# Altium schematic sheet mcu.SchDoc: MCU
size A4; Author: Peilin Perry Xu; CompanyName: N/A; DrawnBy: Peilin Perry Xu; Engineer: Peilin Perry Xu; Organization: N/A; Address1: 89 Chestnut Street, Toronto, ON, Canada; Address2: 79 Brass Drive, Richmond Hill, ON, Canada; DocumentNumber: 8; Revision: 1; SheetNumber: 11; SheetTotal: 11
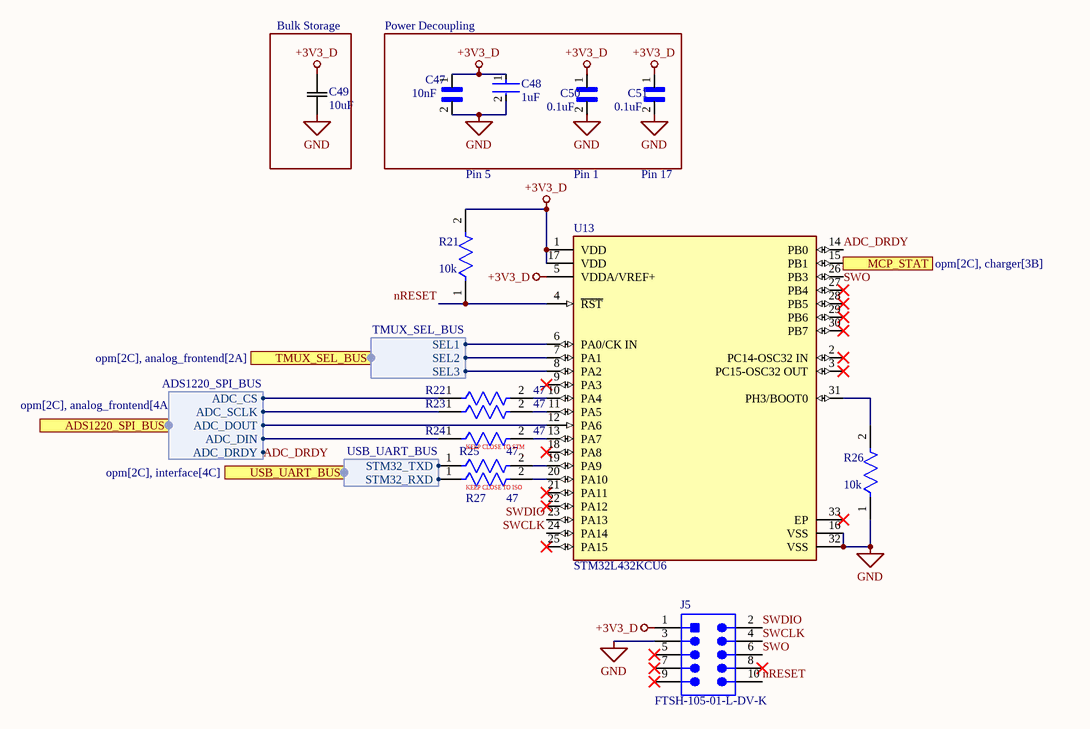
[diagram p0: mcu.SchDoc]

## Parts
C47  10nF  [CC0603JRX7R8BB104]
C48  1uF  [CC0805KKX7R7BB106]
C49  10uF  [CC0805KKX7R7BB106]
C50  0.1uF  [CC0603JRX7R8BB104]
C51  0.1uF  [CC0603JRX7R8BB104]
J5  FTSH-105-01-L-DV-K  [SMTC-FTSH-105-01-L-DV-K_V]
R21  10k  [RC0603FR-07]
R22  47  [RC0603FR-07]
R23  47  [RC0603FR-07]
R24  47  [RC0603FR-07]
R25  47  [RC0603FR-07]
R26  10k  [RC0603FR-07]
R27  47  [RC0603FR-07]
U13  STM32L432KCU6  [STM32L432KCU6]

## Blocks framed on the sheet
Bulk Storage: C49
Power Decoupling: C47 C48 C50 C51

## Ports
ADS1220_SPI_BUS (harness ADS1220_SPI_BUS, see opm[2C], analog_frontend[4A]), MCP_STAT (in, see opm[2C], charger[3B]), TMUX_SEL_BUS (harness TMUX_SEL_BUS, see opm[2C], analog_frontend[2A]), USB_UART_BUS (harness USB_UART_BUS, see opm[2C], interface[4C])

## Harnesses
USB_UART_BUS: STM32_RXD, STM32_TXD
ADS1220_SPI_BUS: ADC_CS, ADC_DIN, ADC_DOUT, ADC_SCLK, ADC_DRDY
TMUX_SEL_BUS: SEL1, SEL2, SEL3

## Nets
+3V3_D: C47.1 C48.1 C49.1 C50.1 C51.1 J5.1 R21.2 U13.1(VDD) U13.5(VDDA/VREF+) U13.17(VDD)
GND: C47.2 C48.2 C49.2 C50.2 C51.2 J5.3 R26.1 U13.16(VSS) U13.32(VSS)
ADC_DRDY: U13.14(PB0) ; port ADS1220_SPI_BUS.ADC_DRDY
MCP_STAT: U13.15(PB1) ; port MCP_STAT
nRESET: J5.10 R21.1 U13.4(~{RST})
SWCLK: J5.4 U13.24(PA14)
SWDIO: J5.2 U13.23(PA13)
SWO: J5.6 U13.26(PB3)
NetR22_1: R22.1 ; port ADS1220_SPI_BUS.ADC_CS
NetR22_2: R22.2 U13.10(PA4)
NetR23_1: R23.1 ; port ADS1220_SPI_BUS.ADC_SCLK
NetR23_2: R23.2 U13.11(PA5)
NetR24_1: R24.1 ; port ADS1220_SPI_BUS.ADC_DIN
NetR24_2: R24.2 U13.13(PA7)
NetR25_1: R25.1 ; port USB_UART_BUS.STM32_TXD
NetR25_2: R25.2 U13.19(PA9)
NetR26_2: R26.2 U13.31(PH3/BOOT0)
NetR27_1: R27.1 ; port USB_UART_BUS.STM32_RXD
NetR27_2: R27.2 U13.20(PA10)
NetU13_6: U13.6(PA0/CK_IN) ; port TMUX_SEL_BUS.SEL1
NetU13_7: U13.7(PA1) ; port TMUX_SEL_BUS.SEL2
NetU13_8: U13.8(PA2) ; port TMUX_SEL_BUS.SEL3
NetU13_12: U13.12(PA6) ; port ADS1220_SPI_BUS.ADC_DOUT

Not connected (* = marked no-connect by the designer): J5 5* 7* 8* 9*; U13 2(PC14-OSC32_IN)* 3(PC15-OSC32_OUT)* 9(PA3)* 18(PA8)* 21(PA11)* 22(PA12)* 25(PA15)* 27(PB4)* 28(PB5)* 29(PB6)* 30(PB7)* 33(EP)*

## Notes on the sheet
- Pin 5
- Pin 1
- Pin 17
- KEEP CLOSE TO STM
- (near R27) KEEP CLOSE TO ISO

## Library data of the parts
C47 = CC0603JRX7R8BB103: 25V 10nF X7R ±5% 0603 Multilayer Ceramic Capacitors MLCC - SMD/SMT ROHS; Manufacturer: Yageo Group; Dissipation Factor: 2.5%; Insulation Resistance: 10GΩ; Supplier: DigiKey; Supplier Part Number: 311-3995-1-ND; Manufacturer Part Number: CC0603JRX7R8BB103; RoHS: Compliant; Category: Ceramic Capacitors; Stock: 4508; Pricing: 1=0.1, 10=0.046, 50=0.0312, 100=0.0269, 500=0.01954, 1000=0.01728 (USD); Value: 10nF; Case/Package: 0603; Case Code (Imperial): 0603; Case Code (Metric): 1608; China RoHS: Compliant; Composition: Ceramic; Country of Origin: Mainland China, Taiwan; Depth: 800µm; Dielectric: X7R; Dielectric Material: Ceramic; Export Control Classification Number (ECCN) Code: EAR99; Halogen Free: Halogen Free; Height: 800µm; Harmonized Tariff Schedule (HTS) Code: 8532.24.00.20; Introduction Date: 2003-01-27; Lead Free: Lead Free; Length: 1.6mm; Lifecycle Status: Production; Max Operating Temperature: 125°C; Min Operating Temperature: -55°C; Mounting Technology: Surface Mount; Number of Terminals: 2; Radiation Hardening: No; REACH SVHC: Yes; Schedule B: 8532240020, 8532240020|8532240020|8532240020|8532240020|8532240020; Termination: SMD/SMT; Thickness: 889µm; Tolerance: 5%; Voltage Rating: 25V; Voltage Rating (DC): 25V; Weight: 2.012816mg; Width: 800µm; ComponentLink1URL: https://datasheet.octopart.com:443/CC0603JRX7R8BB103-Yageo-datasheet-177165144.pdf?src-supplier=IHS; ComponentLink1Description: https://datasheet.octopart.com:443/CC0603JRX7R8BB103-Yageo-datasheet-177165144.pdf?src-supplier=IHS; ComponentLink2URL: https://datasheet.octopart.com:443/CC0603JRX7R8BB103-Yageo-datasheet-182029658.pdf?src-supplier=Farnell; ComponentLink2Description: https://datasheet.octopart.com:443/CC0603JRX7R8BB103-Yageo-datasheet-182029658.pdf?src-supplier=Farnell; ComponentLink3URL: https://datasheet.octopart.com:443/CC0603JRX7R8BB103-Yageo-datasheet-182029654.pdf?src-supplier=Farnell; ComponentLink3Description: https://datasheet.octopart.com:443/CC0603JRX7R8BB103-Yageo-datasheet-182029654.pdf?src-supplier=Farnell; ComponentLink4URL: https://datasheet.octopart.com:443/CC0603JRX7R8BB103-Yageo-datasheet-147453679.pdf?src-supplier=Farnell; ComponentLink4Description: https://datasheet.octopart.com:443/CC0603JRX7R8BB103-Yageo-datasheet-147453679.pdf?src-supplier=Farnell; ComponentLink5URL: https://datasheet.octopart.com:443/CC0603JRX7R8BB103-Yageo-datasheet-151948686.pdf?src-supplier=Farnell; ComponentLink5Description: https://datasheet.octopart.com:443/CC0603JRX7R8BB103-Yageo-datasheet-151948686.pdf?src-supplier=Farnell; ComponentLink6URL: https://datasheet.octopart.com/CC0603JRX7R8BB103-Yageo-datasheet-10883670.pdf; ComponentLink6Description: https://datasheet.octopart.com/CC0603JRX7R8BB103-Yageo-datasheet-10883670.pdf; ComponentLink7URL: https://datasheet.octopart.com:443/CC0603JRX7R8BB103-Yageo-datasheet-166511530.pdf?src-supplier=Future+Electronics; ComponentLink7Description: https://datasheet.octopart.com:443/CC0603JRX7R8BB103-Yageo-datasheet-166511530.pdf?src-supplier=Future+Electronics; ComponentLink8URL: https://datasheet.octopart.com:443/CC0603JRX7R8BB103-Yageo-datasheet-137700082.pdf?src-supplier=Future+Electronics; ComponentLink8Description: https://datasheet.octopart.com:443/CC0603JRX7R8BB103-Yageo-datasheet-137700082.pdf?src-supplier=Future+Electronics; ComponentLink9URL: https://datasheet.octopart.com:443/CC0603JRX7R8BB103-Yageo-datasheet-137700084.pdf?src-supplier=Future+Electronics; ComponentLink9Description: https://datasheet.octopart.com:443/CC0603JRX7R8BB103-Yageo-datasheet-137700084.pdf?src-supplier=Future+Electronics; ComponentLink10URL: https://datasheet.octopart.com:443/CC0603JRX7R8BB103-Yageo-datasheet-27626582.pdf?src-supplier=Future+Electronics; ComponentLink10Description: https://datasheet.octopart.com:443/CC0603JRX7R8BB103-Yageo-datasheet-27626582.pdf?src-supplier=Future+Electronics; ComponentLink11URL: https://datasheet.octopart.com:443/CC0603JRX7R8BB103-Yageo-datasheet-15895757.pdf?src-supplier=Future+Electronics; ComponentLink11Description: https://datasheet.octopart.com:443/CC0603JRX7R8BB103-Yageo-datasheet-15895757.pdf?src-supplier=Future+Electronics; ComponentLink12URL: https://datasheet.octopart.com:443/CC0603JRX7R8BB103-Yageo-datasheet-12526321.pdf?src-supplier=Future+Electronics; ComponentLink12Description: https://datasheet.octopart.com:443/CC0603JRX7R8BB103-Yageo-datasheet-12526321.pdf?src-supplier=Future+Electronics; ComponentLink13URL: https://datasheet.octopart.com:443/CC0603JRX7R8BB103-Yageo-datasheet-10911834.pdf?src-supplier=Future+Electronics; ComponentLink13Description: https://datasheet.octopart.com:443/CC0603JRX7R8BB103-Yageo-datasheet-10911834.pdf?src-supplier=Future+Electronics; ComponentLink14URL: https://datasheet.octopart.com:443/CC0603JRX7R8BB103-Yageo-datasheet-8324442.pdf?src-supplier=Future+Electronics; ComponentLink14Description: https://datasheet.octopart.com:443/CC0603JRX7R8BB103-Yageo-datasheet-8324442.pdf?src-supplier=Future+Electronics; ComponentLink15URL: https://datasheet.octopart.com:443/CC0603JRX7R8BB103-Yageo-Group-datasheet-165992755.pdf?src-supplier=ODG+(Origin+Data+Global); ComponentLink15Description: https://datasheet.octopart.com:443/CC0603JRX7R8BB103-Yageo-Group-datasheet-165992755.pdf?src-supplier=ODG+(Origin+Data+Global); ComponentLink16URL: http://sigma.octopart.com:80/conflict_mineral_statement/Yageo-company-3.pdf?src-supplier=Compliance+Statements; ComponentLink16Description: http://sigma.octopart.com:80/conflict_mineral_statement/Yageo-company-3.pdf?src-supplier=Compliance+Statements; ComponentLink17URL: http://sigma.octopart.com:80/rohs_statement/Yageo-company-2.pdf?src-supplier=Compliance+Statements; ComponentLink17Description: http://sigma.octopart.com:80/rohs_statement/Yageo-company-2.pdf?src-supplier=Compliance+Statements; Supplier 1: DigiKey; Supplier Part Number 1: 311-3995-1-ND
C48 = CC0805KKX7R7BB105: 16V 1uF X7R ±10% 0805 Multilayer Ceramic Capacitors MLCC - SMD/SMT ROHS; Manufacturer: Yageo Group; Manufacturer Package Identifier: CC0805-0.85; Value: 1µF; Supplier: DigiKey; Supplier Part Number: 311-1365-1-ND; Manufacturer Part Number: CC0805KKX7R7BB105; RoHS: Compliant; Category: Ceramic Capacitors; Stock: 898629; Pricing: 1=0.13, 10=0.072, 50=0.05, 100=0.0434, 500=0.0323, 1000=0.02889 (USD); Case/Package: 0805; Case Code (Imperial): 0805; Case Code (Metric): 2012; China RoHS: Compliant; Country of Origin: Mainland China, Taiwan; Depth: 1.25mm; Dielectric: X7R; Dielectric Material: Ceramic; Export Control Classification Number (ECCN) Code: EAR99; Halogen Free: Halogen Free; Height: 1.25mm; Harmonized Tariff Schedule (HTS) Code: 8532.24.00.20; Introduction Date: 2009-04-17; Lead Free: Lead Free; Length: 2mm; Lifecycle Status: Production; Material: Ceramic; Max Operating Temperature: 125°C; Min Operating Temperature: -55°C; Mounting Technology: Surface Mount; Pins: 2; Number of Terminals: 2; Radiation Hardening: No; REACH SVHC: Yes; Schedule B: 8532240020, 8532240020|8532240020|8532240020|8532240020|8532240020|8532240020|8532240020|8532240020|8532240020|8532240020|8532240020|8532240020, 8532240020|8532240020|8532240020|8532240020|8532240020|8532240020|8532240020|8532240020|8532240020|8532240020|8532240020|8532240020|8532240020, 8532240020|8532240020|8532240020|8532240020|8532240020|8532240020|8532240020|8532240020|8532240020|8532240020|8532240020|8532240020|8532240020|8532240020; Termination: SMD/SMT; Thickness: 1.2446mm; Tolerance: 10%; Voltage Rating: 16V; Voltage Rating (DC): 16V; Width: 1.25mm; ComponentLink1URL: https://datasheet.octopart.com:443/CC0805KKX7R7BB105-Yageo-datasheet-177165144.pdf?src-supplier=IHS; ComponentLink1Description: https://datasheet.octopart.com:443/CC0805KKX7R7BB105-Yageo-datasheet-177165144.pdf?src-supplier=IHS; ComponentLink2URL: https://datasheet.octopart.com:443/CC0805KKX7R7BB105-Yageo-datasheet-78855689.pdf?src-supplier=Upverter; ComponentLink2Description: https://datasheet.octopart.com:443/CC0805KKX7R7BB105-Yageo-datasheet-78855689.pdf?src-supplier=Upverter; ComponentLink3URL: https://datasheet.octopart.com:443/CC0805KKX7R7BB105-Yageo-Group-datasheet-189192896.pdf?src-supplier=Future+Electronics; ComponentLink3Description: https://datasheet.octopart.com:443/CC0805KKX7R7BB105-Yageo-Group-datasheet-189192896.pdf?src-supplier=Future+Electronics; ComponentLink4URL: https://datasheet.octopart.com:443/CC0805KKX7R7BB105-Yageo-datasheet-166511530.pdf?src-supplier=Future+Electronics; ComponentLink4Description: https://datasheet.octopart.com:443/CC0805KKX7R7BB105-Yageo-datasheet-166511530.pdf?src-supplier=Future+Electronics; ComponentLink5URL: https://datasheet.octopart.com:443/CC0805KKX7R7BB105-Yageo-datasheet-137700082.pdf?src-supplier=Future+Electronics; ComponentLink5Description: https://datasheet.octopart.com:443/CC0805KKX7R7BB105-Yageo-datasheet-137700082.pdf?src-supplier=Future+Electronics; ComponentLink6URL: https://datasheet.octopart.com:443/CC0805KKX7R7BB105-Yageo-datasheet-137700084.pdf?src-supplier=Future+Electronics; ComponentLink6Description: https://datasheet.octopart.com:443/CC0805KKX7R7BB105-Yageo-datasheet-137700084.pdf?src-supplier=Future+Electronics; ComponentLink7URL: https://datasheet.octopart.com:443/CC0805KKX7R7BB105-Yageo-datasheet-27626582.pdf?src-supplier=Future+Electronics; ComponentLink7Description: https://datasheet.octopart.com:443/CC0805KKX7R7BB105-Yageo-datasheet-27626582.pdf?src-supplier=Future+Electronics; ComponentLink8URL: https://datasheet.octopart.com:443/CC0805KKX7R7BB105-Yageo-datasheet-15895757.pdf?src-supplier=Future+Electronics; ComponentLink8Description: https://datasheet.octopart.com:443/CC0805KKX7R7BB105-Yageo-datasheet-15895757.pdf?src-supplier=Future+Electronics; ComponentLink9URL: https://datasheet.octopart.com:443/CC0805KKX7R7BB105-Yageo-datasheet-12526321.pdf?src-supplier=Future+Electronics; ComponentLink9Description: https://datasheet.octopart.com:443/CC0805KKX7R7BB105-Yageo-datasheet-12526321.pdf?src-supplier=Future+Electronics; ComponentLink10URL: https://datasheet.octopart.com:443/CC0805KKX7R7BB105-Yageo-datasheet-10911834.pdf?src-supplier=Future+Electronics; ComponentLink10Description: https://datasheet.octopart.com:443/CC0805KKX7R7BB105-Yageo-datasheet-10911834.pdf?src-supplier=Future+Electronics; ComponentLink11URL: https://datasheet.octopart.com:443/CC0805KKX7R7BB105-Yageo-datasheet-8324442.pdf?src-supplier=Future+Electronics; ComponentLink11Description: https://datasheet.octopart.com:443/CC0805KKX7R7BB105-Yageo-datasheet-8324442.pdf?src-supplier=Future+Electronics; ComponentLink12URL: https://datasheet.octopart.com/CC0805KKX7R7BB105-Yageo-datasheet-10883670.pdf; ComponentLink12Description: https://datasheet.octopart.com/CC0805KKX7R7BB105-Yageo-datasheet-10883670.pdf; ComponentLink13URL: https://datasheet.octopart.com:443/CC0805KKX7R7BB105-Yageo-datasheet-140260305.pdf?src-supplier=SOS+electronic; ComponentLink13Description: https://datasheet.octopart.com:443/CC0805KKX7R7BB105-Yageo-datasheet-140260305.pdf?src-supplier=SOS+electronic; ComponentLink14URL: https://datasheet.octopart.com:443/CC0805KKX7R7BB105-Yageo-datasheet-147453679.pdf?src-supplier=Farnell; ComponentLink14Description: https://datasheet.octopart.com:443/CC0805KKX7R7BB105-Yageo-datasheet-147453679.pdf?src-supplier=Farnell; ComponentLink15URL: https://datasheet.octopart.com:443/CC0805KKX7R7BB105-Yageo-datasheet-181969634.pdf?src-supplier=Farnell; ComponentLink15Description: https://datasheet.octopart.com:443/CC0805KKX7R7BB105-Yageo-datasheet-181969634.pdf?src-supplier=Farnell; ComponentLink16URL: https://datasheet.octopart.com:443/CC0805KKX7R7BB105-Yageo-datasheet-62336348.pdf?src-supplier=element14+APAC; ComponentLink16Description: https://datasheet.octopart.com:443/CC0805KKX7R7BB105-Yageo-datasheet-62336348.pdf?src-supplier=element14+APAC; ComponentLink17URL: https://datasheet.octopart.com:443/CC0805KKX7R7BB105-Yageo-Group-datasheet-165992755.pdf?src-supplier=ODG+(Origin+Data+Global); ComponentLink17Description: https://datasheet.octopart.com:443/CC0805KKX7R7BB105-Yageo-Group-datasheet-165992755.pdf?src-supplier=ODG+(Origin+Data+Global); ComponentLink18URL: https://datasheet.octopart.com:443/CC0805KKX7R7BB105-Yageo-datasheet-151948686.pdf?src-supplier=TME; ComponentLink18Description: https://datasheet.octopart.com:443/CC0805KKX7R7BB105-Yageo-datasheet-151948686.pdf?src-supplier=TME; ComponentLink19URL: https://datasheet.octopart.com:443/CC0805KKX7R7BB105-Yageo-datasheet-8324192.pdf?src-supplier=TME; ComponentLink19Description: https://datasheet.octopart.com:443/CC0805KKX7R7BB105-Yageo-datasheet-8324192.pdf?src-supplier=TME; ComponentLink20URL: https://datasheet.octopart.com:443/CC0805KKX7R7BB105-Yageo-datasheet-120101875.pdf?src-supplier=Megastar; ComponentLink20Description: https://datasheet.octopart.com:443/CC0805KKX7R7BB105-Yageo-datasheet-120101875.pdf?src-supplier=Megastar; ComponentLink21URL: https://datasheet.octopart.com:443/CC0805KKX7R7BB105-Yageo-datasheet-8701427.pdf?src-supplier=element14; ComponentLink21Description: https://datasheet.octopart.com:443/CC0805KKX7R7BB105-Yageo-datasheet-8701427.pdf?src-supplier=element14; ComponentLink22URL: https://datasheet.octopart.com:443/CC0805KKX7R7BB105-Yageo-datasheet-499490.pdf?src-supplier=element14; ComponentLink22Description: https://datasheet.octopart.com:443/CC0805KKX7R7BB105-Yageo-datasheet-499490.pdf?src-supplier=element14; ComponentLink23URL: https://datasheet.octopart.com:443/CC0805KKX7R7BB105-Yageo-datasheet-5301394.pdf?src-supplier=element14; ComponentLink23Description: https://datasheet.octopart.com:443/CC0805KKX7R7BB105-Yageo-datasheet-5301394.pdf?src-supplier=element14; ComponentLink24URL: http://sigma.octopart.com:80/conflict_mineral_statement/Yageo-company-3.pdf?src-supplier=Compliance+Statements; ComponentLink24Description: http://sigma.octopart.com:80/conflict_mineral_statement/Yageo-company-3.pdf?src-supplier=Compliance+Statements; ComponentLink25URL: http://sigma.octopart.com:80/rohs_statement/Yageo-company-2.pdf?src-supplier=Compliance+Statements; ComponentLink25Description: http://sigma.octopart.com:80/rohs_statement/Yageo-company-2.pdf?src-supplier=Compliance+Statements; Supplier 1: DigiKey; Supplier Part Number 1: 311-1365-1-ND
C49 = CC0805KKX7R7BB106: 16V 10uF X7R ±10% 0805 Multilayer Ceramic Capacitors MLCC - SMD/SMT ROHS; Manufacturer: Yageo Group; Value: 10µF; Supplier: DigiKey; Supplier Part Number: 311-3501-1-ND; Manufacturer Part Number: CC0805KKX7R7BB106; RoHS: Compliant; Category: Ceramic Capacitors; Stock: 2785; Pricing: 1=0.54, 10=0.329, 50=0.2472, 100=0.2222, 500=0.17992, 1000=0.16687 (USD); Case/Package: 0805; China RoHS: Compliant; Country of Origin: Mainland China, Taiwan; Dielectric: X7R; Dielectric Material: Ceramic; Export Control Classification Number (ECCN) Code: EAR99; Halogen Free: Halogen Free; Height: 1.25mm; Harmonized Tariff Schedule (HTS) Code: 8532.24.00.20; Introduction Date: 2013-05-20; Lead Free: Lead Free; Length: 2mm; Lifecycle Status: Production; Max Operating Temperature: 125°C; Min Operating Temperature: -55°C; Mounting Technology: Surface Mount; Number of Terminals: 2; REACH SVHC: Yes; Voltage Rating (DC): 16V; Width: 1.25mm; ComponentLink1URL: https://datasheet.octopart.com:443/CC0805KKX7R7BB106-Yageo-datasheet-177165144.pdf?src-supplier=IHS; ComponentLink1Description: https://datasheet.octopart.com:443/CC0805KKX7R7BB106-Yageo-datasheet-177165144.pdf?src-supplier=IHS; ComponentLink2URL: https://datasheet.octopart.com:443/CC0805KKX7R7BB106-Yageo-Group-datasheet-189192896.pdf?src-supplier=TME; ComponentLink2Description: https://datasheet.octopart.com:443/CC0805KKX7R7BB106-Yageo-Group-datasheet-189192896.pdf?src-supplier=TME; ComponentLink3URL: https://datasheet.octopart.com:443/CC0805KKX7R7BB106-Yageo-datasheet-147453679.pdf?src-supplier=Farnell; ComponentLink3Description: https://datasheet.octopart.com:443/CC0805KKX7R7BB106-Yageo-datasheet-147453679.pdf?src-supplier=Farnell; ComponentLink4URL: https://datasheet.octopart.com:443/CC0805KKX7R7BB106-Yageo-datasheet-181969636.pdf?src-supplier=Farnell; ComponentLink4Description: https://datasheet.octopart.com:443/CC0805KKX7R7BB106-Yageo-datasheet-181969636.pdf?src-supplier=Farnell; ComponentLink5URL: https://datasheet.octopart.com:443/CC0805KKX7R7BB106-Yageo-datasheet-151948686.pdf?src-supplier=Farnell; ComponentLink5Description: https://datasheet.octopart.com:443/CC0805KKX7R7BB106-Yageo-datasheet-151948686.pdf?src-supplier=Farnell; ComponentLink6URL: https://datasheet.octopart.com:443/CC0805KKX7R7BB106-Yageo-datasheet-166511530.pdf?src-supplier=Future+Electronics; ComponentLink6Description: https://datasheet.octopart.com:443/CC0805KKX7R7BB106-Yageo-datasheet-166511530.pdf?src-supplier=Future+Electronics; ComponentLink7URL: https://datasheet.octopart.com:443/CC0805KKX7R7BB106-Yageo-Group-datasheet-165992755.pdf?src-supplier=ODG+(Origin+Data+Global); ComponentLink7Description: https://datasheet.octopart.com:443/CC0805KKX7R7BB106-Yageo-Group-datasheet-165992755.pdf?src-supplier=ODG+(Origin+Data+Global); ComponentLink8URL: https://datasheet.octopart.com/CC0805KKX7R7BB106-Yageo-datasheet-10883670.pdf; ComponentLink8Description: https://datasheet.octopart.com/CC0805KKX7R7BB106-Yageo-datasheet-10883670.pdf; ComponentLink9URL: http://sigma.octopart.com:80/conflict_mineral_statement/Yageo-company-3.pdf?src-supplier=Compliance+Statements; ComponentLink9Description: http://sigma.octopart.com:80/conflict_mineral_statement/Yageo-company-3.pdf?src-supplier=Compliance+Statements; ComponentLink10URL: http://sigma.octopart.com:80/rohs_statement/Yageo-company-2.pdf?src-supplier=Compliance+Statements; ComponentLink10Description: http://sigma.octopart.com:80/rohs_statement/Yageo-company-2.pdf?src-supplier=Compliance+Statements; Supplier 1: DigiKey; Supplier Part Number 1: 311-3501-1-ND
C50 C51 = CC0603JRX7R8BB104: 25V 100nF X7R ±5% 0603 Multilayer Ceramic Capacitors MLCC - SMD/SMT ROHS; Manufacturer: Yageo Group; Supplier: DigiKey; Supplier Part Number: 311-1777-1-ND; Manufacturer Part Number: CC0603JRX7R8BB104; RoHS: Compliant; Category: Ceramic Capacitors; Stock: 156739; Pricing: 1=0.1, 10=0.056, 50=0.0386, 100=0.0333, 500=0.02444, 1000=0.02172 (USD); Value: 100nF; Case/Package: 0603; Case Code (Imperial): 0603; Case Code (Metric): 1608; China RoHS: Compliant; Composition: Ceramic; Depth: 800µm; Dielectric: X7R; Dielectric Material: Ceramic; Halogen Free: Halogen Free; Height: 800µm; Lead Free: Lead Free; Length: 1.6mm; Lifecycle Status: Production; Max Operating Temperature: 125°C; Min Operating Temperature: -55°C; Mounting Technology: Surface Mount; Number of Terminals: 2; Radiation Hardening: No; REACH SVHC: Yes; Schedule B: 8532240020, 8532240020|8532240020, 8532240020|8532240020|8532240020, 8532240020|8532240020|8532240020|8532240020; Termination: SMD/SMT; Thickness: 889µm; Tolerance: 5%; Voltage Rating: 25V; Voltage Rating (DC): 25V; Weight: 2.012816mg; Width: 800µm; ComponentLink1URL: https://datasheet.octopart.com:443/CC0603JRX7R8BB104-Yageo-datasheet-177165144.pdf?src-supplier=IHS; ComponentLink1Description: https://datasheet.octopart.com:443/CC0603JRX7R8BB104-Yageo-datasheet-177165144.pdf?src-supplier=IHS; ComponentLink2URL: https://datasheet.octopart.com:443/CC0603JRX7R8BB104-Yageo-datasheet-147453679.pdf?src-supplier=Farnell; ComponentLink2Description: https://datasheet.octopart.com:443/CC0603JRX7R8BB104-Yageo-datasheet-147453679.pdf?src-supplier=Farnell; ComponentLink3URL: https://datasheet.octopart.com:443/CC0603JRX7R8BB104-Yageo-datasheet-181968346.pdf?src-supplier=Farnell; ComponentLink3Description: https://datasheet.octopart.com:443/CC0603JRX7R8BB104-Yageo-datasheet-181968346.pdf?src-supplier=Farnell; ComponentLink4URL: https://datasheet.octopart.com:443/CC0603JRX7R8BB104-Yageo-datasheet-151948686.pdf?src-supplier=TME; ComponentLink4Description: https://datasheet.octopart.com:443/CC0603JRX7R8BB104-Yageo-datasheet-151948686.pdf?src-supplier=TME; ComponentLink5URL: https://datasheet.octopart.com/CC0603JRX7R8BB104-Yageo-datasheet-12526321.pdf; ComponentLink5Description: https://datasheet.octopart.com/CC0603JRX7R8BB104-Yageo-datasheet-12526321.pdf; ComponentLink6URL: https://datasheet.octopart.com/CC0603JRX7R8BB104-Yageo-datasheet-10883670.pdf; ComponentLink6Description: https://datasheet.octopart.com/CC0603JRX7R8BB104-Yageo-datasheet-10883670.pdf; ComponentLink7URL: https://datasheet.octopart.com:443/CC0603JRX7R8BB104-Yageo-datasheet-166511530.pdf?src-supplier=Future+Electronics; ComponentLink7Description: https://datasheet.octopart.com:443/CC0603JRX7R8BB104-Yageo-datasheet-166511530.pdf?src-supplier=Future+Electronics; ComponentLink8URL: https://datasheet.octopart.com:443/CC0603JRX7R8BB104-Yageo-datasheet-137700082.pdf?src-supplier=Future+Electronics; ComponentLink8Description: https://datasheet.octopart.com:443/CC0603JRX7R8BB104-Yageo-datasheet-137700082.pdf?src-supplier=Future+Electronics; ComponentLink9URL: https://datasheet.octopart.com:443/CC0603JRX7R8BB104-Yageo-datasheet-137700084.pdf?src-supplier=Future+Electronics; ComponentLink9Description: https://datasheet.octopart.com:443/CC0603JRX7R8BB104-Yageo-datasheet-137700084.pdf?src-supplier=Future+Electronics; ComponentLink10URL: https://datasheet.octopart.com:443/CC0603JRX7R8BB104-Yageo-datasheet-27626582.pdf?src-supplier=Future+Electronics; ComponentLink10Description: https://datasheet.octopart.com:443/CC0603JRX7R8BB104-Yageo-datasheet-27626582.pdf?src-supplier=Future+Electronics; ComponentLink11URL: https://datasheet.octopart.com:443/CC0603JRX7R8BB104-Yageo-datasheet-15895757.pdf?src-supplier=Future+Electronics; ComponentLink11Description: https://datasheet.octopart.com:443/CC0603JRX7R8BB104-Yageo-datasheet-15895757.pdf?src-supplier=Future+Electronics; ComponentLink12URL: https://datasheet.octopart.com:443/CC0603JRX7R8BB104-Yageo-datasheet-10911834.pdf?src-supplier=Future+Electronics; ComponentLink12Description: https://datasheet.octopart.com:443/CC0603JRX7R8BB104-Yageo-datasheet-10911834.pdf?src-supplier=Future+Electronics; ComponentLink13URL: https://datasheet.octopart.com:443/CC0603JRX7R8BB104-Yageo-datasheet-8324442.pdf?src-supplier=Future+Electronics; ComponentLink13Description: https://datasheet.octopart.com:443/CC0603JRX7R8BB104-Yageo-datasheet-8324442.pdf?src-supplier=Future+Electronics; ComponentLink14URL: https://datasheet.octopart.com:443/CC0603JRX7R8BB104-Yageo-Group-datasheet-165992755.pdf?src-supplier=ODG+(Origin+Data+Global); ComponentLink14Description: https://datasheet.octopart.com:443/CC0603JRX7R8BB104-Yageo-Group-datasheet-165992755.pdf?src-supplier=ODG+(Origin+Data+Global); ComponentLink15URL: http://sigma.octopart.com:80/rohs_statement/Surface-Mount-Ceramic-Multilayer-Capacitors%3B-General-Purpose-%26-High-Capacitance-Class-2%2C-X7R-Yageo-family-124.pdf?src-supplier=Compliance+Statements; ComponentLink15Description: http://sigma.octopart.com:80/rohs_statement/Surface-Mount-Ceramic-Multilayer-Capacitors%3B-General-Purpose-%26-High-Capacitance-Class-2%2C-X7R-Yageo-family-124.pdf?src-supplier=Compliance+Statements; ComponentLink16URL: http://sigma.octopart.com:80/reach_statement/Surface-Mount-Ceramic-Multilayer-Capacitors%3B-General-Purpose-%26-High-Capacitance-Class-2%2C-X7R-Yageo-family-125.pdf?src-supplier=Compliance+Statements; ComponentLink16Description: http://sigma.octopart.com:80/reach_statement/Surface-Mount-Ceramic-Multilayer-Capacitors%3B-General-Purpose-%26-High-Capacitance-Class-2%2C-X7R-Yageo-family-125.pdf?src-supplier=Compliance+Statements; ComponentLink17URL: http://sigma.octopart.com:80/conflict_mineral_statement/Yageo-company-3.pdf?src-supplier=Compliance+Statements; ComponentLink17Description: http://sigma.octopart.com:80/conflict_mineral_statement/Yageo-company-3.pdf?src-supplier=Compliance+Statements; ComponentLink18URL: http://sigma.octopart.com:80/rohs_statement/Yageo-company-2.pdf?src-supplier=Compliance+Statements; ComponentLink18Description: http://sigma.octopart.com:80/rohs_statement/Yageo-company-2.pdf?src-supplier=Compliance+Statements; Supplier 1: DigiKey; Supplier Part Number 1: 311-1777-1-ND
J5 = FTSH-105-01-L-DV-K: Conn Shrouded Header (2 Sides) HDR 10 POS 1.27mm Solder ST Top Entry SMD TIGER CLAW™ Tube; Manufacturer: Samtec; Manufacturer Lifecycle Status: PRODUCTION; Connector Type: Male Pin; Gender: Female; Max Current Rating: 1.75A; Number of Contacts: 10; Supplier: DigiKey; Supplier Part Number: SAM8799-ND; Manufacturer Part Number: FTSH-105-01-L-DV-K; RoHS: Compliant; Category: Headers and Wire Housings; Stock: 29958; Pricing: 1=2.48, 100=1.95, 250=1.76, 500=1.55, 1000=1.36, 2500=1.23, 5000=1.15, 10000=0.99 (USD); Color: Black; Contact Material: Bronze; Contact Mating Length: 3.048mm; Contact Plating: Gold; Depth: 3.43mm; Housing Color: Black; Housing Material: Polymer; Lead Free: Lead Free; Length: 6.35mm; Lifecycle Status: Production; Max Operating Temperature: 125°C; Min Operating Temperature: -55°C; Mounting Technology: Surface Mount; Pins: 10; Number of Positions: 10; Number of Rows: 2; Pitch: 1.27mm; Radiation Hardening: No; REACH SVHC: No; Row Spacing: 1.27mm; Termination: Solder; ComponentLink1URL: https://datasheet.octopart.com:443/FTSH-105-01-L-DV-K-Samtec-datasheet-140825048.pdf?src-supplier=Electro+Sonic; ComponentLink1Description: https://datasheet.octopart.com:443/FTSH-105-01-L-DV-K-Samtec-datasheet-140825048.pdf?src-supplier=Electro+Sonic; ComponentLink2URL: https://datasheet.octopart.com:443/FTSH-105-01-L-DV-K-Samtec-datasheet-86818370.pdf?src-supplier=Upverter; ComponentLink2Description: https://datasheet.octopart.com:443/FTSH-105-01-L-DV-K-Samtec-datasheet-86818370.pdf?src-supplier=Upverter; ComponentLink3URL: https://datasheet.octopart.com:443/FTSH-105-01-L-DV-K-Samtec-datasheet-97029545.pdf?src-supplier=Newark; ComponentLink3Description: https://datasheet.octopart.com:443/FTSH-105-01-L-DV-K-Samtec-datasheet-97029545.pdf?src-supplier=Newark; ComponentLink4URL: https://datasheet.octopart.com:443/FTSH-105-01-L-DV-K-Samtec-datasheet-41642889.pdf?src-supplier=Newark; ComponentLink4Description: https://datasheet.octopart.com:443/FTSH-105-01-L-DV-K-Samtec-datasheet-41642889.pdf?src-supplier=Newark; ComponentLink5URL: https://sigma.octopart.com:443/140871554/technical_drawing/Samtec-FTSH-105-01-L-DV-K.pdf?src-supplier=Samtec; ComponentLink5Description: https://sigma.octopart.com:443/140871554/technical_drawing/Samtec-FTSH-105-01-L-DV-K.pdf?src-supplier=Samtec; ComponentLink6URL: https://sigma.octopart.com:443/97029548/technical_drawing/Samtec-FTSH-105-01-L-DV-K.pdf?src-supplier=Samtec; ComponentLink6Description: https://sigma.octopart.com:443/97029548/technical_drawing/Samtec-FTSH-105-01-L-DV-K.pdf?src-supplier=Samtec; ComponentLink7URL: https://datasheet.octopart.com:443/FTSH-105-01-L-DV-K-Samtec-datasheet-100454331.pdf?src-supplier=Farnell; ComponentLink7Description: https://datasheet.octopart.com:443/FTSH-105-01-L-DV-K-Samtec-datasheet-100454331.pdf?src-supplier=Farnell; ComponentLink8URL: https://datasheet.octopart.com:443/FTSH-105-01-L-DV-K-Samtec-datasheet-33007714.pdf?src-supplier=Farnell; ComponentLink8Description: https://datasheet.octopart.com:443/FTSH-105-01-L-DV-K-Samtec-datasheet-33007714.pdf?src-supplier=Farnell; ComponentLink9URL: https://datasheet.octopart.com:443/FTSH-105-01-L-DV-K-Samtec-datasheet-16646209.pdf?src-supplier=element14+APAC; ComponentLink9Description: https://datasheet.octopart.com:443/FTSH-105-01-L-DV-K-Samtec-datasheet-16646209.pdf?src-supplier=element14+APAC; ComponentLink10URL: https://datasheet.octopart.com:443/FTSH-105-01-L-DV-K-Samtec-datasheet-180249087.pdf?src-supplier=JRH+Electronics; ComponentLink10Description: https://datasheet.octopart.com:443/FTSH-105-01-L-DV-K-Samtec-datasheet-180249087.pdf?src-supplier=JRH+Electronics; ComponentLink11URL: https://datasheet.octopart.com:443/FTSH-105-01-L-DV-K-Samtec-datasheet-176663386.pdf?src-supplier=Toby+Electronics; ComponentLink11Description: https://datasheet.octopart.com:443/FTSH-105-01-L-DV-K-Samtec-datasheet-176663386.pdf?src-supplier=Toby+Electronics; ComponentLink12URL: https://datasheet.octopart.com:443/FTSH-105-01-L-DV-K-Samtec-datasheet-133497664.pdf?src-supplier=Toby+Electronics; ComponentLink12Description: https://datasheet.octopart.com:443/FTSH-105-01-L-DV-K-Samtec-datasheet-133497664.pdf?src-supplier=Toby+Electronics; ComponentLink13URL: https://datasheet.octopart.com:443/FTSH-105-01-L-DV-K-Samtec-datasheet-116535196.pdf?src-supplier=Toby+Electronics; ComponentLink13Description: https://datasheet.octopart.com:443/FTSH-105-01-L-DV-K-Samtec-datasheet-116535196.pdf?src-supplier=Toby+Electronics; ComponentLink14URL: https://datasheet.octopart.com:443/FTSH-105-01-L-DV-K-Samtec-datasheet-151470459.pdf?src-supplier=Sager+Electronics; ComponentLink14Description: https://datasheet.octopart.com:443/FTSH-105-01-L-DV-K-Samtec-datasheet-151470459.pdf?src-supplier=Sager+Electronics; ComponentLink15URL: https://datasheet.octopart.com:443/FTSH-105-01-L-DV-K-Samtec-datasheet-151470458.pdf?src-supplier=Sager+Electronics; ComponentLink15Description: https://datasheet.octopart.com:443/FTSH-105-01-L-DV-K-Samtec-datasheet-151470458.pdf?src-supplier=Sager+Electronics; ComponentLink16URL: https://datasheet.octopart.com:443/FTSH-105-01-L-DV-K-Samtec-datasheet-137316104.pdf?src-supplier=Future+Electronics; ComponentLink16Description: https://datasheet.octopart.com:443/FTSH-105-01-L-DV-K-Samtec-datasheet-137316104.pdf?src-supplier=Future+Electronics; ComponentLink17URL: https://datasheet.octopart.com/FTSH-105-01-L-DV-K-Samtec-datasheet-13696953.pdf; ComponentLink17Description: https://datasheet.octopart.com/FTSH-105-01-L-DV-K-Samtec-datasheet-13696953.pdf; ComponentLink18URL: https://datasheet.octopart.com/FTSH-105-01-L-DV-K-Samtec-datasheet-11553404.pdf; ComponentLink18Description: https://datasheet.octopart.com/FTSH-105-01-L-DV-K-Samtec-datasheet-11553404.pdf; Supplier 1: DigiKey; Supplier Part Number 1: SAM8799-ND
R21 R26 = RC0603FR-0710KL: 100mW Thick Film Resistors 75V ±100ppm/℃ ±1% 10kΩ 0603 Chip Resistor - Surface Mount ROHS; Manufacturer: Yageo Group; Temperature Coefficient: 100ppm/°C; Voltage Rating (DC): 50V; Supplier: DigiKey; Supplier Part Number: 311-10.0KHRCT-ND; Manufacturer Part Number: RC0603FR-0710KL; RoHS: Compliant; Category: Chip SMD Resistors; Stock: 4661379; Pricing: 1=0.1, 10=0.010, 25=0.0088, 50=0.0072, 100=0.0066, 250=0.00568 (USD); Case/Package: 0603; Case Code (Imperial): 0603; Case Code (Metric): 0603; China RoHS: Non-Compliant; Composition: Thick Film; Depth: 800µm; Height: 450µm; Lead Free: Lead Free; Lead Pitch: 300µm; Length: 1.6mm; Lifecycle Status: Production; Max Operating Temperature: 155°C; Military Standard: Not; Min Operating Temperature: -55°C; Mounting Technology: Surface Mount; Pins: 2; Number of Terminals: 2; Packaging: Tape & Reel; Power Dissipation: 100mW; Power Rating: 100mW; REACH SVHC: Yes; Value: 10kΩ; Schedule B: 8533210045, 8533210045|8533210045|8533210045|8533210045|8533210045|8533210045|8533210045|8533210045|8533210045|8533210045|8533210045|8533210045|8533210045|8533210045|8533210045|8533210045|8533210045|8533210045|8533210045|8533210045|8533210045|8533210045|8533210045|85; Termination: SMD/SMT; Tolerance: 1%; Voltage Rating: 75V; Weight: 2.012816mg; Width: 800µm; Working Voltage: 75V; ComponentLink1URL: https://datasheet.octopart.com:443/RC0603FR-0710KL-Yageo-datasheet-175887523.pdf?src-supplier=IHS; ComponentLink1Description: https://datasheet.octopart.com:443/RC0603FR-0710KL-Yageo-datasheet-175887523.pdf?src-supplier=IHS; ComponentLink2URL: https://datasheet.octopart.com:443/RC0603FR-0710KL-Yageo-datasheet-103092701.pdf?src-supplier=Upverter; ComponentLink2Description: https://datasheet.octopart.com:443/RC0603FR-0710KL-Yageo-datasheet-103092701.pdf?src-supplier=Upverter; ComponentLink3URL: https://datasheet.octopart.com:443/RC0603FR-0710KL-Yageo-datasheet-98239111.pdf?src-supplier=Upverter; ComponentLink3Description: https://datasheet.octopart.com:443/RC0603FR-0710KL-Yageo-datasheet-98239111.pdf?src-supplier=Upverter; ComponentLink4URL: https://datasheet.octopart.com:443/RC0603FR-0710KL-Yageo-datasheet-141265859.pdf?src-supplier=Upverter; ComponentLink4Description: https://datasheet.octopart.com:443/RC0603FR-0710KL-Yageo-datasheet-141265859.pdf?src-supplier=Upverter; ComponentLink5URL: https://sigma.octopart.com:443/138820526/technical_drawing/Yageo-RC0603FR-0710KL.pdf?src-supplier=Upverter; ComponentLink5Description: https://sigma.octopart.com:443/138820526/technical_drawing/Yageo-RC0603FR-0710KL.pdf?src-supplier=Upverter; ComponentLink6URL: https://datasheet.octopart.com:443/RC0603FR-0710KL-Yageo-datasheet-8328172.pdf?src-supplier=Farnell; ComponentLink6Description: https://datasheet.octopart.com:443/RC0603FR-0710KL-Yageo-datasheet-8328172.pdf?src-supplier=Farnell; ComponentLink7URL: https://datasheet.octopart.com:443/RC0603FR-0710KL-Yageo-datasheet-13691069.pdf?src-supplier=Farnell; ComponentLink7Description: https://datasheet.octopart.com:443/RC0603FR-0710KL-Yageo-datasheet-13691069.pdf?src-supplier=Farnell; ComponentLink8URL: https://datasheet.octopart.com:443/RC0603FR-0710KL-Yageo-datasheet-62067350.pdf?src-supplier=element14+APAC; ComponentLink8Description: https://datasheet.octopart.com:443/RC0603FR-0710KL-Yageo-datasheet-62067350.pdf?src-supplier=element14+APAC; ComponentLink9URL: https://datasheet.octopart.com:443/RC0603FR-0710KL-Yageo-datasheet-17842380.pdf?src-supplier=element14+APAC; ComponentLink9Description: https://datasheet.octopart.com:443/RC0603FR-0710KL-Yageo-datasheet-17842380.pdf?src-supplier=element14+APAC; ComponentLink10URL: https://datasheet.octopart.com:443/RC0603FR-0710KL-Yageo-datasheet-15599030.pdf?src-supplier=Future+Electronics; ComponentLink10Description: https://datasheet.octopart.com:443/RC0603FR-0710KL-Yageo-datasheet-15599030.pdf?src-supplier=Future+Electronics; ComponentLink11URL: https://datasheet.octopart.com:443/RC0603FR-0710KL-Yageo-Group-datasheet-176638170.pdf?src-supplier=Future+Electronics; ComponentLink11Description: https://datasheet.octopart.com:443/RC0603FR-0710KL-Yageo-Group-datasheet-176638170.pdf?src-supplier=Future+Electronics; ComponentLink12URL: https://datasheet.octopart.com:443/RC0603FR-0710KL-Yageo-datasheet-164759695.pdf?src-supplier=Future+Electronics; ComponentLink12Description: https://datasheet.octopart.com:443/RC0603FR-0710KL-Yageo-datasheet-164759695.pdf?src-supplier=Future+Electronics; ComponentLink13URL: https://datasheet.octopart.com:443/RC0603FR-0710KL-Yageo-datasheet-127823281.pdf?src-supplier=Future+Electronics; ComponentLink13Description: https://datasheet.octopart.com:443/RC0603FR-0710KL-Yageo-datasheet-127823281.pdf?src-supplier=Future+Electronics; ComponentLink14URL: https://datasheet.octopart.com:443/RC0603FR-0710KL-Yageo-datasheet-137700087.pdf?src-supplier=Future+Electronics; ComponentLink14Description: https://datasheet.octopart.com:443/RC0603FR-0710KL-Yageo-datasheet-137700087.pdf?src-supplier=Future+Electronics; ComponentLink15URL: https://datasheet.octopart.com:443/RC0603FR-0710KL-Yageo-datasheet-27584510.pdf?src-supplier=Future+Electronics; ComponentLink15Description: https://datasheet.octopart.com:443/RC0603FR-0710KL-Yageo-datasheet-27584510.pdf?src-supplier=Future+Electronics; ComponentLink16URL: https://datasheet.octopart.com:443/RC0603FR-0710KL-Yageo-datasheet-8324193.pdf?src-supplier=Future+Electronics; ComponentLink16Description: https://datasheet.octopart.com:443/RC0603FR-0710KL-Yageo-datasheet-8324193.pdf?src-supplier=Future+Electronics; ComponentLink17URL: https://datasheet.octopart.com:443/RC0603FR-0710KL-Yageo-datasheet-12596169.pdf?src-supplier=Newark; ComponentLink17Description: https://datasheet.octopart.com:443/RC0603FR-0710KL-Yageo-datasheet-12596169.pdf?src-supplier=Newark; ComponentLink18URL: https://datasheet.octopart.com:443/RC0603FR-0710KL-Yageo-datasheet-503470.pdf?src-supplier=Newark; ComponentLink18Description: https://datasheet.octopart.com:443/RC0603FR-0710KL-Yageo-datasheet-503470.pdf?src-supplier=Newark; ComponentLink19URL: https://datasheet.octopart.com:443/RC0603FR-0710KL-Yageo-datasheet-34211833.pdf?src-supplier=Newark; ComponentLink19Description: https://datasheet.octopart.com:443/RC0603FR-0710KL-Yageo-datasheet-34211833.pdf?src-supplier=Newark; ComponentLink20URL: https://datasheet.octopart.com:443/RC0603FR-0710KL-Yageo-datasheet-79472498.pdf?src-supplier=Megastar; ComponentLink20Description: https://datasheet.octopart.com:443/RC0603FR-0710KL-Yageo-datasheet-79472498.pdf?src-supplier=Megastar; ComponentLink21URL: https://datasheet.octopart.com/RC0603FR-0710KL-Yageo-datasheet-73766026.pdf; ComponentLink21Description: https://datasheet.octopart.com/RC0603FR-0710KL-Yageo-datasheet-73766026.pdf; ComponentLink22URL: https://datasheet.octopart.com:443/RC0603FR-0710KL-Yageo-datasheet-118562.pdf?src-supplier=DigiKey; ComponentLink22Description: https://datasheet.octopart.com:443/RC0603FR-0710KL-Yageo-datasheet-118562.pdf?src-supplier=DigiKey; ComponentLink23URL: http://sigma.octopart.com:80/conflict_mineral_statement/Yageo-company-3.pdf?src-supplier=Compliance+Statements; ComponentLink23Description: http://sigma.octopart.com:80/conflict_mineral_statement/Yageo-company-3.pdf?src-supplier=Compliance+Statements; ComponentLink24URL: http://sigma.octopart.com:80/rohs_statement/Yageo-company-2.pdf?src-supplier=Compliance+Statements; ComponentLink24Description: http://sigma.octopart.com:80/rohs_statement/Yageo-company-2.pdf?src-supplier=Compliance+Statements; Supplier 1: DigiKey; Supplier Part Number 1: 311-10.0KHRCT-ND
R22-R25 R27 = RC0603FR-0747RL: 100mW Thick Film Resistors 75V ±100ppm/℃ ±1% 47Ω 0603 Chip Resistor - Surface Mount ROHS; Manufacturer: Yageo Group; Temperature Coefficient: 100ppm/°C; Voltage Rating: 50V; Supplier: DigiKey; Supplier Part Number: 311-47.0HRCT-ND; Manufacturer Part Number: RC0603FR-0747RL; RoHS: Compliant; Category: Chip SMD Resistors; Stock: 424421; Pricing: 1=0.1, 10=0.008, 25=0.0072, 50=0.0062, 100=0.0057 (USD); Case/Package: 0603; Case Code (Imperial): 0603; Case Code (Metric): 1608; China RoHS: Non-Compliant; Composition: Thick Film; Depth: 800µm; Features: Moisture Resistant; Height: 450µm; Lead Free: Lead Free; Length: 1.6mm; Lifecycle Status: Production; Max Operating Temperature: 155°C; Max Power Dissipation: 100mW; Military Standard: Not; Min Operating Temperature: -55°C; Mounting Technology: Surface Mount; Pins: 2; Number of Terminals: 2; Number of Terminations: 2; Packaging: Tape and Reel; Power Dissipation: 100mW; Power Rating: 100mW; REACH SVHC: Yes; Value: 47Ω; Schedule B: 8533210045, 8533210045|8533210045, 8533210045|8533210045|8533210045, 8533210045|8533210045|8533210045|8533210045; Termination: SMD/SMT; Tolerance: 1%; Voltage Rating (AC): 50V; Voltage Rating (DC): 50V; Weight: 2.012816mg; Width: 800µm; Working Voltage: 75V; ComponentLink1URL: https://datasheet.octopart.com:443/RC0603FR-0747RL-Yageo-datasheet-175887523.pdf?src-supplier=IHS; ComponentLink1Description: https://datasheet.octopart.com:443/RC0603FR-0747RL-Yageo-datasheet-175887523.pdf?src-supplier=IHS; ComponentLink2URL: https://datasheet.octopart.com:443/RC0603FR-0747RL-Yageo-datasheet-62067350.pdf?src-supplier=Newark; ComponentLink2Description: https://datasheet.octopart.com:443/RC0603FR-0747RL-Yageo-datasheet-62067350.pdf?src-supplier=Newark; ComponentLink3URL: https://datasheet.octopart.com:443/RC0603FR-0747RL-Yageo-datasheet-12596169.pdf?src-supplier=Newark; ComponentLink3Description: https://datasheet.octopart.com:443/RC0603FR-0747RL-Yageo-datasheet-12596169.pdf?src-supplier=Newark; ComponentLink4URL: https://datasheet.octopart.com:443/RC0603FR-0747RL-Yageo-datasheet-164759695.pdf?src-supplier=Upverter; ComponentLink4Description: https://datasheet.octopart.com:443/RC0603FR-0747RL-Yageo-datasheet-164759695.pdf?src-supplier=Upverter; ComponentLink5URL: https://datasheet.octopart.com:443/RC0603FR-0747RL-Yageo-datasheet-103092701.pdf?src-supplier=Upverter; ComponentLink5Description: https://datasheet.octopart.com:443/RC0603FR-0747RL-Yageo-datasheet-103092701.pdf?src-supplier=Upverter; ComponentLink6URL: https://datasheet.octopart.com:443/RC0603FR-0747RL-Yageo-datasheet-141435368.pdf?src-supplier=Upverter; ComponentLink6Description: https://datasheet.octopart.com:443/RC0603FR-0747RL-Yageo-datasheet-141435368.pdf?src-supplier=Upverter; ComponentLink7URL: https://datasheet.octopart.com:443/RC0603FR-0747RL-Yageo-Group-datasheet-190305687.pdf?src-supplier=Future+Electronics; ComponentLink7Description: https://datasheet.octopart.com:443/RC0603FR-0747RL-Yageo-Group-datasheet-190305687.pdf?src-supplier=Future+Electronics; ComponentLink8URL: https://datasheet.octopart.com:443/RC0603FR-0747RL-Yageo-datasheet-137700087.pdf?src-supplier=Future+Electronics; ComponentLink8Description: https://datasheet.octopart.com:443/RC0603FR-0747RL-Yageo-datasheet-137700087.pdf?src-supplier=Future+Electronics; ComponentLink9URL: https://datasheet.octopart.com:443/RC0603FR-0747RL-Yageo-datasheet-127823281.pdf?src-supplier=Future+Electronics; ComponentLink9Description: https://datasheet.octopart.com:443/RC0603FR-0747RL-Yageo-datasheet-127823281.pdf?src-supplier=Future+Electronics; ComponentLink10URL: https://datasheet.octopart.com:443/RC0603FR-0747RL-Yageo-datasheet-27584510.pdf?src-supplier=Future+Electronics; ComponentLink10Description: https://datasheet.octopart.com:443/RC0603FR-0747RL-Yageo-datasheet-27584510.pdf?src-supplier=Future+Electronics; ComponentLink11URL: https://datasheet.octopart.com:443/RC0603FR-0747RL-Yageo-datasheet-15599030.pdf?src-supplier=Future+Electronics; ComponentLink11Description: https://datasheet.octopart.com:443/RC0603FR-0747RL-Yageo-datasheet-15599030.pdf?src-supplier=Future+Electronics; ComponentLink12URL: https://datasheet.octopart.com:443/RC0603FR-0747RL-Yageo-datasheet-503470.pdf?src-supplier=Future+Electronics; ComponentLink12Description: https://datasheet.octopart.com:443/RC0603FR-0747RL-Yageo-datasheet-503470.pdf?src-supplier=Future+Electronics; ComponentLink13URL: https://datasheet.octopart.com:443/RC0603FR-0747RL-Yageo-datasheet-8328172.pdf?src-supplier=element14+APAC; ComponentLink13Description: https://datasheet.octopart.com:443/RC0603FR-0747RL-Yageo-datasheet-8328172.pdf?src-supplier=element14+APAC; ComponentLink14URL: https://datasheet.octopart.com:443/RC0603FR-0747RL-Yageo-datasheet-34211833.pdf?src-supplier=element14+APAC; ComponentLink14Description: https://datasheet.octopart.com:443/RC0603FR-0747RL-Yageo-datasheet-34211833.pdf?src-supplier=element14+APAC; ComponentLink15URL: https://datasheet.octopart.com:443/RC0603FR-0747RL-Yageo-datasheet-148775077.pdf?src-supplier=TME; ComponentLink15Description: https://datasheet.octopart.com:443/RC0603FR-0747RL-Yageo-datasheet-148775077.pdf?src-supplier=TME; ComponentLink16URL: https://datasheet.octopart.com/RC0603FR-0747RL-Yageo-datasheet-73766026.pdf; ComponentLink16Description: https://datasheet.octopart.com/RC0603FR-0747RL-Yageo-datasheet-73766026.pdf; ComponentLink17URL: https://datasheet.octopart.com:443/RC0603FR-0747RL-Yageo-datasheet-13691069.pdf?src-supplier=Farnell; ComponentLink17Description: https://datasheet.octopart.com:443/RC0603FR-0747RL-Yageo-datasheet-13691069.pdf?src-supplier=Farnell; ComponentLink18URL: https://datasheet.octopart.com:443/RC0603FR-0747RL-Yageo-datasheet-118562.pdf?src-supplier=DigiKey; ComponentLink18Description: https://datasheet.octopart.com:443/RC0603FR-0747RL-Yageo-datasheet-118562.pdf?src-supplier=DigiKey; ComponentLink19URL: http://sigma.octopart.com:80/conflict_mineral_statement/Yageo-company-3.pdf?src-supplier=Compliance+Statements; ComponentLink19Description: http://sigma.octopart.com:80/conflict_mineral_statement/Yageo-company-3.pdf?src-supplier=Compliance+Statements; ComponentLink20URL: http://sigma.octopart.com:80/rohs_statement/Yageo-company-2.pdf?src-supplier=Compliance+Statements; ComponentLink20Description: http://sigma.octopart.com:80/rohs_statement/Yageo-company-2.pdf?src-supplier=Compliance+Statements; Supplier 1: DigiKey; Supplier Part Number 1: 311-47.0HRCT-ND
U13 = STM32L432KCU6: MCU 32-bit Ultra Low Power STM32L ARM Cortex-M4 RISC 256kB Flash 32-Pin QFN ECOPACK2 Tray; Manufacturer: STMicroelectronics; ADC Channels (Resolution): 10-Ch 12-Bit; DAC Channels (Resolution): 2-Ch 12-Bit; Data Bus Width: 32b; EEPROM Memory Size: 0B; Frequency: 80MHz; Interface: CAN, QSPI, USB; Clock Frequency: 48MHz; Max Junction Temperature (Tj): 105°C; Max Supply Current: 9.8mA; Max Supply Voltage: 3.6V; Min Supply Voltage: 1.71V; Nominal Supply Current: 10nA; Number of A/D Converters: 1; Number of ADC Channels: 11; Number of Channels: 10; Number of D/A Converters: 2; Number of I/Os: 3; Number of Interrupts: 16; Number of Timers/Counters: 9; Operating Supply Voltage: 1.8V; Peripherals: PWM; RAM Size: 64kB; Supplier: DigiKey; Supplier Part Number: 497-16578-ND; Manufacturer Part Number: STM32L432KCU6; RoHS: Compliant; Category: Microcontrollers; Stock: 7419; Pricing: 1=4.79, 10=3.641, 25=3.3548, 100=3.04, 250=2.88996, 500=2.7995, 1000=2.72507, 2940=2.63456 (USD); Ambient Temperature Range High: 85°C; China RoHS: Compliant; Core Architecture: ARM Cortex-M4; Country of Origin: Mainland China, Taiwan; Export Control Classification Number (ECCN) Code: 3A991.A.2; Flash Memory Size: 256kB; Height: 600µm; Height - Seated (Max): 600µm; Harmonized Tariff Schedule (HTS) Code: 8542.31.00.25; Introduction Date: 2018-05-25; Lead Free: Lead Free; Length: 5mm; Lifecycle Status: Production; Max Operating Temperature: 85°C; Memory Size: 256kB; Memory Format: FLASH; Min Operating Temperature: -40°C; Number of I2C Channels: 2; Pins: 32; Number of PWM Channels: 1; Number of SPI Channels: 2; Number of Terminals: 32; Number of UART Channels: 3; Number of USART Channels: 2; Number of USB Channels: 1; REACH SVHC: Yes; Schedule B: 8542310000, 8542310000|8542310000|8542310000|8542310000|8542310000; Terminal Pitch: 500µm; Width: 5mm; ComponentLink1URL: https://datasheet.octopart.com:443/STM32L432KCU6-STMicroelectronics-datasheet-137130199.pdf?src-supplier=IHS; ComponentLink1Description: https://datasheet.octopart.com:443/STM32L432KCU6-STMicroelectronics-datasheet-137130199.pdf?src-supplier=IHS; ComponentLink2URL: https://datasheet.octopart.com:443/STM32L432KCU6-STMicroelectronics-datasheet-62336852.pdf?src-supplier=SHENGYU+ELECTRONICS; ComponentLink2Description: https://datasheet.octopart.com:443/STM32L432KCU6-STMicroelectronics-datasheet-62336852.pdf?src-supplier=SHENGYU+ELECTRONICS; ComponentLink3URL: https://datasheet.octopart.com:443/STM32L432KCU6-STMicroelectronics-datasheet-62069833.pdf?src-supplier=STMicroelectronics; ComponentLink3Description: https://datasheet.octopart.com:443/STM32L432KCU6-STMicroelectronics-datasheet-62069833.pdf?src-supplier=STMicroelectronics; ComponentLink4URL: https://datasheet.octopart.com:443/STM32L432KCU6-STMicroelectronics-datasheet-104429914.pdf?src-supplier=element14+APAC; ComponentLink4Description: https://datasheet.octopart.com:443/STM32L432KCU6-STMicroelectronics-datasheet-104429914.pdf?src-supplier=element14+APAC; ComponentLink5URL: https://datasheet.octopart.com:443/STM32L432KCU6-STMicroelectronics-datasheet-62336760.pdf?src-supplier=Future+Electronics; ComponentLink5Description: https://datasheet.octopart.com:443/STM32L432KCU6-STMicroelectronics-datasheet-62336760.pdf?src-supplier=Future+Electronics; Supplier 1: DigiKey; Supplier Part Number 1: 497-16578-ND